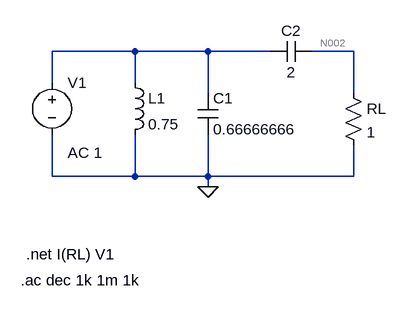
[diagram p0: schematic EJ_1B.asc]
EJ_1B.asc, the LTspice schematic file:
Version 4
SHEET 1 880 680
WIRE 32 80 -96 80
WIRE 144 80 32 80
WIRE 240 80 144 80
WIRE 368 80 304 80
WIRE -96 128 -96 80
WIRE 32 128 32 80
WIRE 144 144 144 80
WIRE 368 144 368 80
WIRE -96 272 -96 208
WIRE 32 272 32 208
WIRE 32 272 -96 272
WIRE 144 272 144 208
WIRE 144 272 32 272
WIRE 368 272 368 224
WIRE 368 272 144 272
WIRE 144 288 144 272
FLAG 144 288 0
SYMBOL ind 16 112 R0
SYMATTR InstName L1
SYMATTR Value 0.75
SYMBOL cap 128 144 R0
SYMATTR InstName C1
SYMATTR Value 0.66666666
SYMBOL cap 304 64 R90
WINDOW 0 0 32 VBottom 2
WINDOW 3 32 32 VTop 2
SYMATTR InstName C2
SYMATTR Value 2
SYMBOL res 352 128 R0
SYMATTR InstName RL
SYMATTR Value 1
SYMBOL voltage -96 112 R0
WINDOW 123 24 124 Left 2
WINDOW 39 0 0 Left 0
SYMATTR Value2 AC 1
SYMATTR InstName V1
SYMATTR Value ""
TEXT -136 392 Left 2 !.net I(RL) V1
TEXT -144 432 Left 2 !.ac dec 1k 1m 1k

The netlist it stands for:
* EJ_1B.asc
L1 N001 0 0.75
C1 N001 0 0.66666666
C2 N002 N001 2
RL N002 0 1
V1 N001 0 AC 1
.net I(RL) V1
.ac dec 1k 1m 1k
.backanno
.end

* Results of the author's LTspice run, read from the files saved beside the schematic
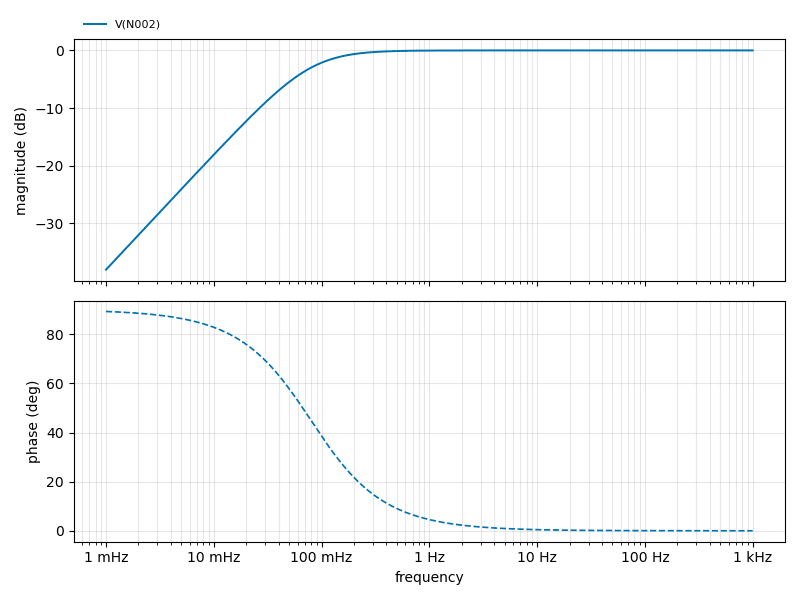
[diagram p1: AC Analysis of EJ_1B.asc, plotted from the saved traces]
* AC Analysis, 1 run:
*   V(N002): -38.02 dB at 1 mHz, -0.00 dB at 1 kHz, peak -0.00 dB at 1 kHz, 3 dB below the peak at 79.58 mHz